# EAGLE design 433 Tx (EAGLE 5.11)
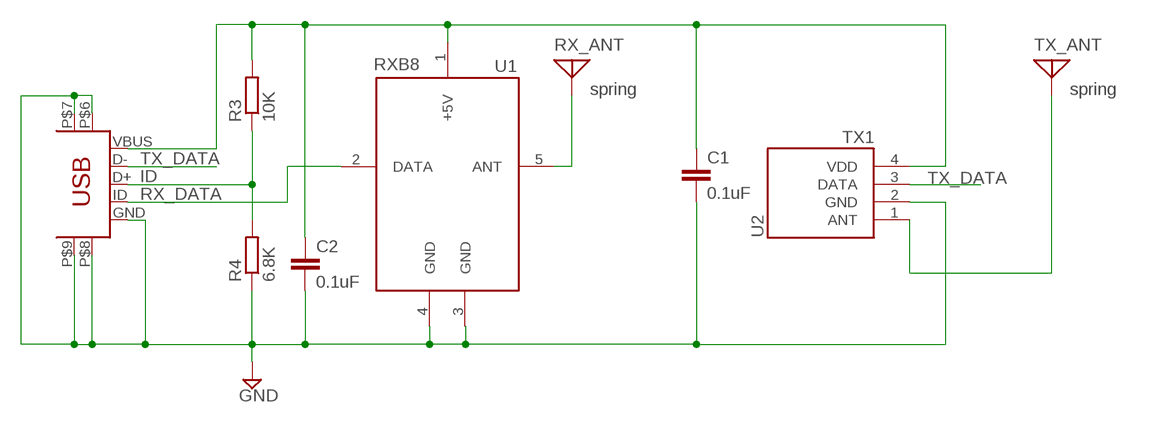
[diagram p0: schematic, sheet 1]

## Parts
C1  0.1uF  C-EU050-024X044  [C050-024X044]
C2  0.1uF  C-EU050-024X044  [C050-024X044]
R3  10K  R-EU_0207/10  [0207/10]
R4  6.8K  R-EU_0207/10  [0207/10]
RX_ANT  spring  ANTENNA  [PAD-01]
TX_ANT  spring  ANTENNA  [PAD-01]
U1  RXB8  [RXB8]
U2  TX1  [TX1]
U$2  MINI_B_PTH  [MINIB_PTH]

## Nets
+5V: C1.1 C2.1 R3.2 U1.1(+5V) U2.4(VDD) U$2.VBUS
GND: C1.2 C2.2 R4.1 U1.3(GND) U1.4(GND) U2.2(GND) U$2.GND U$2.P$6(MTN1) U$2.P$7(MTN2) U$2.P$8(MTN3) U$2.P$9(MTN4)
ID: R3.1 R4.2 U$2.D+
RX_ANT: RX_ANT.1 U1.5(ANT)
RX_DATA: U1.2(DATA) U$2.ID
TX_ANT: TX_ANT.1 U2.1(ANT)
TX_DATA: U2.3(DATA) U$2.D-

## Library data of the parts
C1 C2 = resistor:C-EU: CAPACITOR, European symbol
R3 R4 = resistor:R-EU_: RESISTOR, European symbol
RX_ANT TX_ANT = discrete:ANTENNA: Antenna
U1 = ninja:RXB8: RY-RXB8 ASK Receiving module http://www.relyrf.com/rf/ask_receiver/RY-RXB8.htm
U2 = ninja:TX1
U$2 = ninja:MINI_B_PTH: WUERTH ELEKTRONIK - 651005136521 - MINI USB TYPE B, RECEPTACLE http://au.element14.com/wuerth-elektronik/651005136521/mini-usb-type-b-receptacle-r-a/dp/1841176

## Board
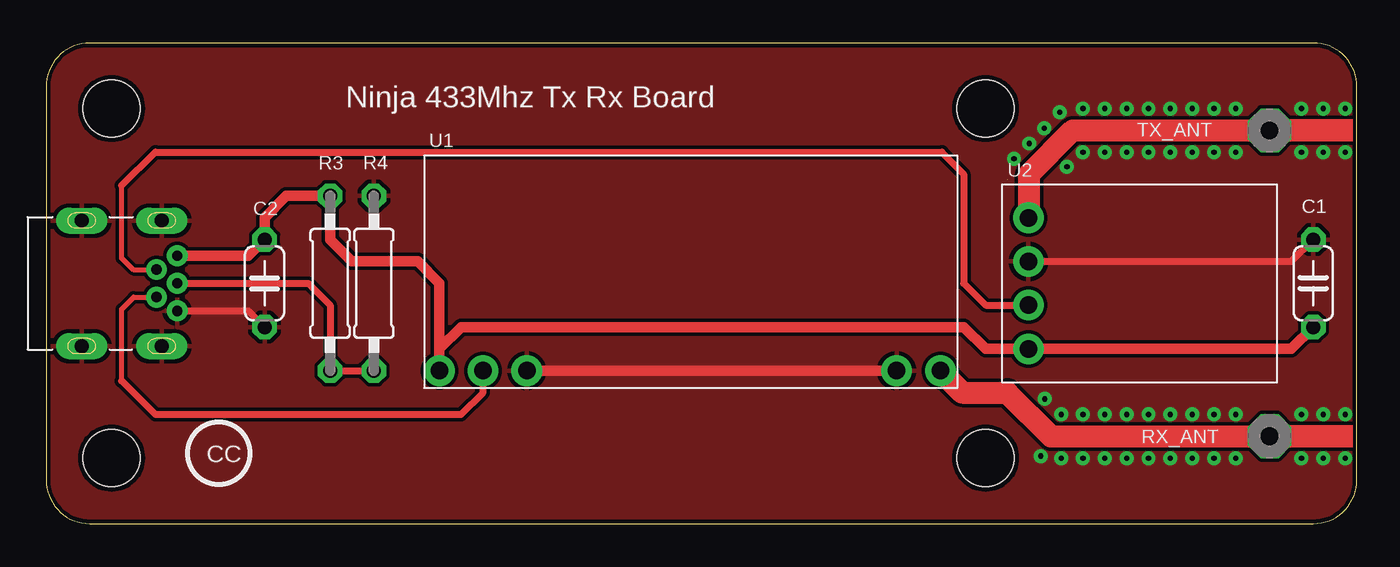
[diagram p1: board, top side]
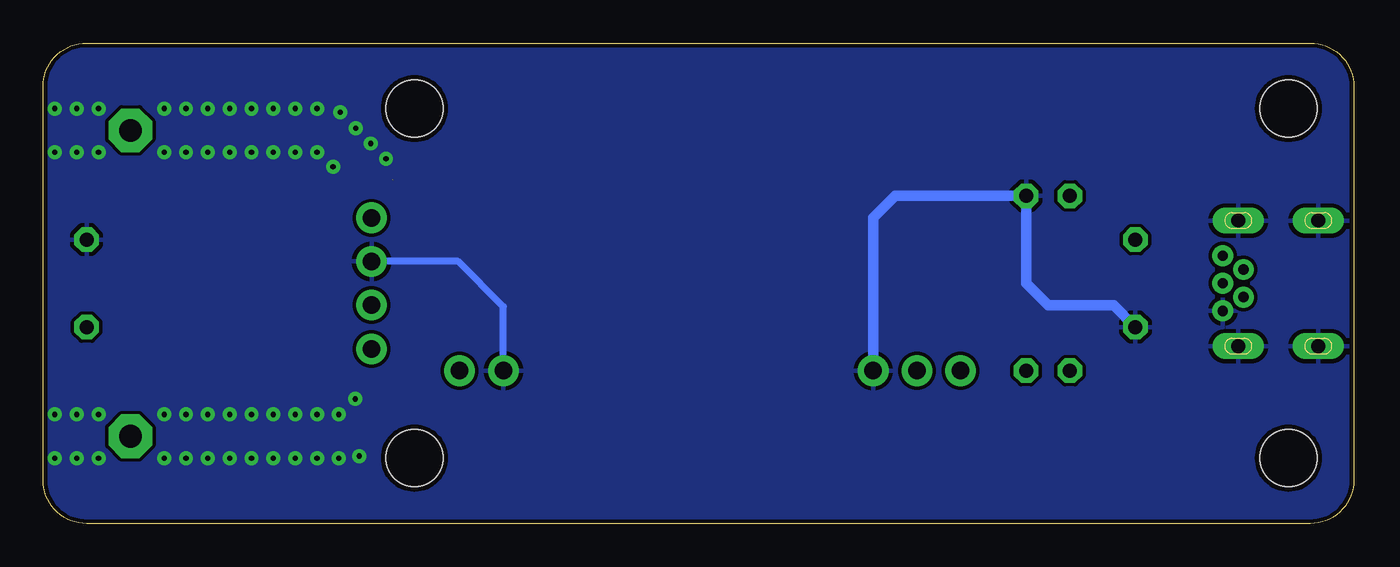
[diagram p2: board, bottom side, seen from below]

Size 76.2 x 27.94 mm. Coordinates in mm from the lower left corner, seen from the top.
Outline: 2.54,0 73.66,0 arc90 76.2,2.54 76.2,25.4 arc90 73.66,27.94 2.54,27.94 arc90 0,25.4 0,2.54 arc90 2.54,0
Copper layers (1*16): Top 0.035mm / dielectric 1.5mm / Bottom 0.035mm
Design rules "SparkFun": minimum track width 8mil, minimum drill 20mil, track to track 8mil, track to pad 8mil, pad to pad 8mil, via to via 8mil, smd to smd 8mil, copper to edge 10mil, drill to drill 8mil, minimum pad ring 12mil, minimum via ring 10mil, stop-mask expansion 4mil, vias tented up to drill 25mil, thermal gap 10mil

### Footprints (pad centres in the part's own frame; a part is rotated, then mirrored left to right if it is on the bottom)
C050-024X044 = drill 0.813 octagon: 1 -2.54,0; 2 2.54,0
0207/10 = drill 0.813 octagon: 1 -5.08,0; 2 5.08,0
PAD-01 = drill 1.321 pad 2.54 octagon: 1 0,0
RXB8 = drill 1.016 pad 1.778 round: 1 -24.13,0; 2 -21.59,0; 3 -19.05,0; 4 2.45,0; 5 4.99,0
TX1 = drill 1.016 pad 1.778 round: 1 0,0; 2 2.54,0; 3 5.08,0; 4 7.62,0
STAND-OFF = hole 3.302: 0,0
MINIB_PTH = drill 0.6 round: D+ 0,0; D- 0.8,1.2; GND -1.6,0; ID -0.8,1.2; VBUS 1.6,0 | drill 0.8 pad 1.5 long: P$6 3.65,0.9; P$7 3.65,5.55; P$8 -3.65,0.9; P$9 -3.65,5.55

### Placement (x,y rotation side)
C1  73.66,13.97 90 top
C2  12.7,13.97 270 top
R3  16.51,13.97 90 top
R4  19.05,13.97 270 top
RX_ANT  71.12,5.08 0 top
TX_ANT  71.12,22.86 0 top
U1  46.99,8.89 0 top
U2  57.1,17.78 270 top
U$1  [STAND-OFF]  3.81,24.13 0 top
U$2  7.62,13.97 90 top
U$3  [STAND-OFF]  3.81,3.81 0 top
U$4  [STAND-OFF]  54.61,3.81 0 top
U$5  [STAND-OFF]  54.61,24.13 0 top

### Tracks (layer width: path | path; a pad name or v marks a point on that pad's centre or on a via)
+5V
  Top 0.61: U$2.VBUS 11.76,15.57 C2.1 12.7,17.78 13.97,19.05 R3.2 16.51,16.51 17.78,15.24 21.59,15.24 22.86,13.97 22.86,10.16 | 22.86,10.16 U1.1 | 22.86,10.16 24.13,11.43 53.34,11.43 54.61,10.16 U2.4 72.39,10.16 C1.1
GND  (via drill 0.3)  (1 unrouted)
  Top 0.406: U$2.GND 11.76,12.37 C2.2 | U2.2 72.39,15.24 C1.2
  Top 0.61: U1.3 U1.4
  Bottom 0.406: U1.4 49.44,12.61 52.07,15.24 U2.2
  Bottom 0.61: U1.3 27.94,17.78 26.67,19.05 R4.1 19.05,13.97 17.78,12.7 13.97,12.7 C2.2
  other vias: 75.51,24.13 74.24,24.13 72.97,24.13 72.97,21.59 74.24,21.59 75.51,21.59 72.97,6.35 74.24,6.35 75.51,6.35 75.51,3.81 74.24,3.81 72.97,3.81 69.16,24.13 67.89,24.13 66.62,24.13 65.35,24.13 64.08,24.13 62.81,24.13 61.54,24.13 60.27,24.13 60.27,21.59 61.54,21.59 62.81,21.59 62.81,21.59 64.08,21.59 65.35,21.59 66.62,21.59 67.89,21.59 69.16,21.59 69.16,6.35 67.89,6.35 66.62,6.35 65.35,6.35 64.08,6.35 62.81,6.35 61.54,6.35 60.27,6.35 59,6.35 59,3.81 60.27,3.81 61.54,3.81 62.81,3.81 64.08,3.81 65.35,3.81 66.62,3.81 67.89,3.81 69.16,3.81 58.93,23.91 58.03,22.99 57.14,22.1 56.26,21.21 59.34,20.74 57.82,3.93 58.05,7.25
  pour Top: -2.54,29.21 -2.54,-2.54 88.9,-2.54 88.9,29.21
  pour Bottom: -2.54,29.21 -2.54,-1.27 88.9,-1.27 88.9,29.21
ID
  Top 0.406: U$2.D+ 15.24,13.97 16.51,12.7 R3.1 R4.2
RX_ANT
  Top 1.27: RX_ANT.1 58.42,5.08 55.88,7.62 53.25,7.62 U1.5
RX_DATA
  Top 0.305: U$2.ID 5.09,13.17 4.39,12.47 4.39,8.31
  Top 0.406: 4.39,8.31 6.35,6.35 24.13,6.35 25.4,7.62 U1.2
TX_ANT
  Top 1.27: TX_ANT.1 59.69,22.86 57.15,20.32 57.15,17.83 U2.1
TX_DATA
  Top 0.305: U$2.D- 5.07,14.77 4.39,15.42 4.39,19.66
  Top 0.406: 4.39,19.66 6.35,21.59 52.07,21.59 53.34,20.32 53.34,13.97 54.61,12.7 U2.3
(copper drawn outside any net)
  shapes: Top area x2

### Text on the board
tPlace: Ninja 433Mhz Tx Rx Board | CC
200bmp: www.ninjablocks.com